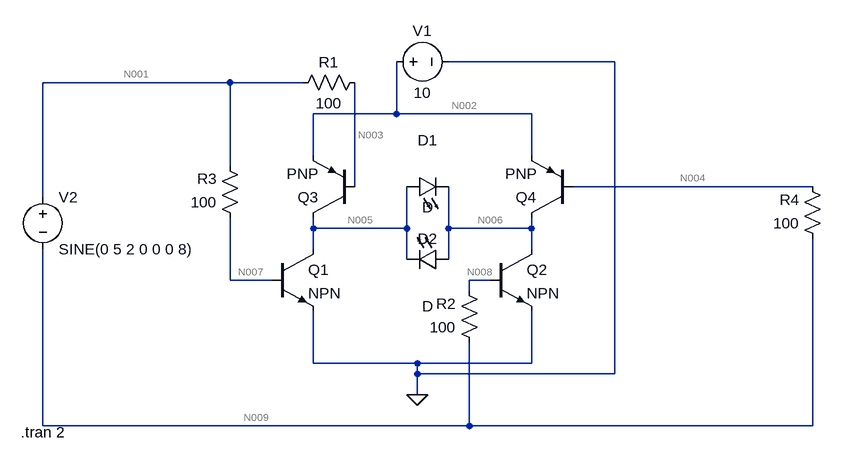
[diagram p0: schematic BJT_BridgeCkt_FWR.asc]
BJT_BridgeCkt_FWR.asc, the LTspice schematic file:
Version 4
SHEET 1 880 680
WIRE 512 -96 256 -96
WIRE -80 -64 -368 -64
WIRE 32 -64 -80 -64
WIRE 176 -16 176 -96
WIRE 176 -16 48 -16
WIRE 384 -16 176 -16
WIRE 48 48 48 -16
WIRE 384 48 384 -16
WIRE -80 64 -80 -64
WIRE 112 96 112 -64
WIRE 816 96 448 96
WIRE -368 112 -368 -64
WIRE 48 160 48 144
WIRE 192 160 192 96
WIRE 192 160 48 160
WIRE 256 160 256 96
WIRE 384 160 384 144
WIRE 384 160 256 160
WIRE 48 192 48 160
WIRE 384 192 384 160
WIRE 192 208 192 160
WIRE 256 208 256 160
WIRE -80 240 -80 144
WIRE -16 240 -80 240
WIRE 320 240 288 240
WIRE 288 256 288 240
WIRE 48 368 48 288
WIRE 208 368 48 368
WIRE 384 368 384 288
WIRE 384 368 208 368
WIRE 208 384 208 368
WIRE 512 384 512 -96
WIRE 512 384 208 384
WIRE 208 416 208 384
WIRE -368 464 -368 192
WIRE 288 464 288 336
WIRE 288 464 -368 464
WIRE 816 464 816 176
WIRE 816 464 288 464
FLAG 208 416 0
SYMBOL npn -16 192 R0
SYMATTR InstName Q1
SYMBOL npn 320 192 R0
SYMATTR InstName Q2
SYMBOL voltage 160 -96 R270
WINDOW 0 32 56 VTop 2
WINDOW 3 -32 56 VBottom 2
SYMATTR InstName V1
SYMATTR Value 10
SYMBOL pnp 112 144 R180
SYMATTR InstName Q3
SYMBOL pnp 448 144 R180
SYMATTR InstName Q4
SYMBOL voltage -368 96 R0
WINDOW 123 24 124 Left 2
WINDOW 39 0 0 Left 0
SYMATTR InstName V2
SYMATTR Value SINE(0 5 2 0 0 0 8)
SYMBOL res -64 160 R180
WINDOW 0 36 76 Left 2
WINDOW 3 36 40 Left 2
SYMATTR InstName R3
SYMATTR Value 100
SYMBOL res 16 -48 R270
WINDOW 0 32 56 VTop 2
WINDOW 3 0 56 VBottom 2
SYMATTR InstName R1
SYMATTR Value 100
SYMBOL res 304 352 R180
WINDOW 0 36 76 Left 2
WINDOW 3 36 40 Left 2
SYMATTR InstName R2
SYMATTR Value 100
SYMBOL res 832 192 R180
WINDOW 0 36 76 Left 2
WINDOW 3 36 40 Left 2
SYMATTR InstName R4
SYMATTR Value 100
SYMBOL LED 192 112 R270
WINDOW 0 72 32 VTop 2
WINDOW 3 0 32 VBottom 2
SYMATTR InstName D1
SYMBOL LED 256 192 R90
WINDOW 0 0 32 VBottom 2
WINDOW 3 72 32 VTop 2
SYMATTR InstName D2
TEXT -402 474 Left 2 !.tran 2

The netlist it stands for:
* BJT_BridgeCkt_FWR.asc
Q1 N005 N007 0 0 NPN
Q2 N006 N008 0 0 NPN
V1 N002 0 10
Q3 N005 N003 N002 0 PNP
Q4 N006 N004 N002 0 PNP
V2 N001 N009 SINE(0 5 2 0 0 0 8)
R3 N007 N001 100
R1 N001 N003 100
R2 N009 N008 100
R4 N009 N004 100
D1 N005 N006 D
D2 N006 N005 D
.model D D
.lib standard.dio
.model NPN NPN
.model PNP PNP
.lib standard.bjt
.tran 2
.backanno
.end

* Results of the author's LTspice run, read from the files saved beside the schematic
* Operating Point, zero values left out:
*   V(n005) = 5 V
*   V(n007) = 988.8 mV
*   V(n006) = 5 V
*   V(n008) = 988.8 mV
*   V(n002) = 10 V
*   V(n003) = 9.011 V
*   V(n004) = 9.011 V
*   V(n001) = 5 V
*   V(n009) = 5 V
*   Ic(Q4) = -4.011 A
*   Ib(Q4) = -40.11 mA
*   Ie(Q4) = 4.051 A
*   Ic(Q3) = -4.011 A
*   Ib(Q3) = -40.11 mA
*   Ie(Q3) = 4.051 A
*   Ic(Q2) = 4.011 A
*   Ib(Q2) = 40.11 mA
*   Ie(Q2) = -4.051 A
*   Ic(Q1) = 4.011 A
*   Ib(Q1) = 40.11 mA
*   Ie(Q1) = -4.051 A
*   I(R4) = -40.11 mA
*   I(R2) = 40.11 mA
*   I(R1) = -40.11 mA
*   I(R3) = -40.11 mA
*   I(V1) = -8.103 A
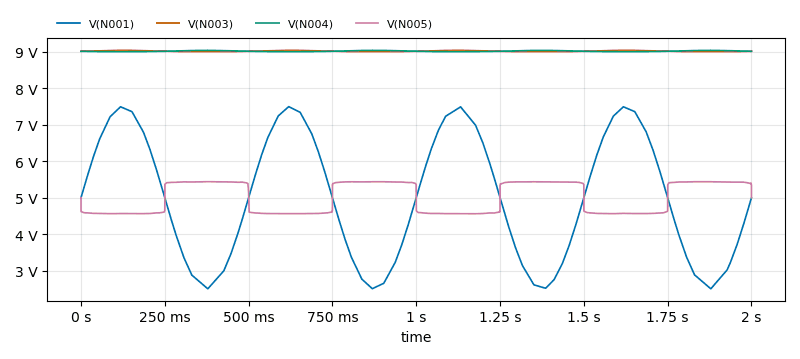
[diagram p1: Transient Analysis of BJT_BridgeCkt_FWR.asc, plotted from the saved traces]
* Transient Analysis, 1 run:
*   V(N001): min 2.504 V, max 7.494 V, average 5.002 V, rms 5.299 V, last 5 V
*   V(N003): min 8.999 V, max 9.036 V, average 9.014 V, rms 9.014 V, last 9.011 V
*   V(N004): min 8.999 V, max 9.036 V, average 9.014 V, rms 9.014 V, last 9.011 V
*   V(N005): min 4.56 V, max 5.438 V, average 5 V, rms 5.018 V, last 4.995 V